# Altium schematic sheet Airbrake Motor Controller.SchDoc
size E
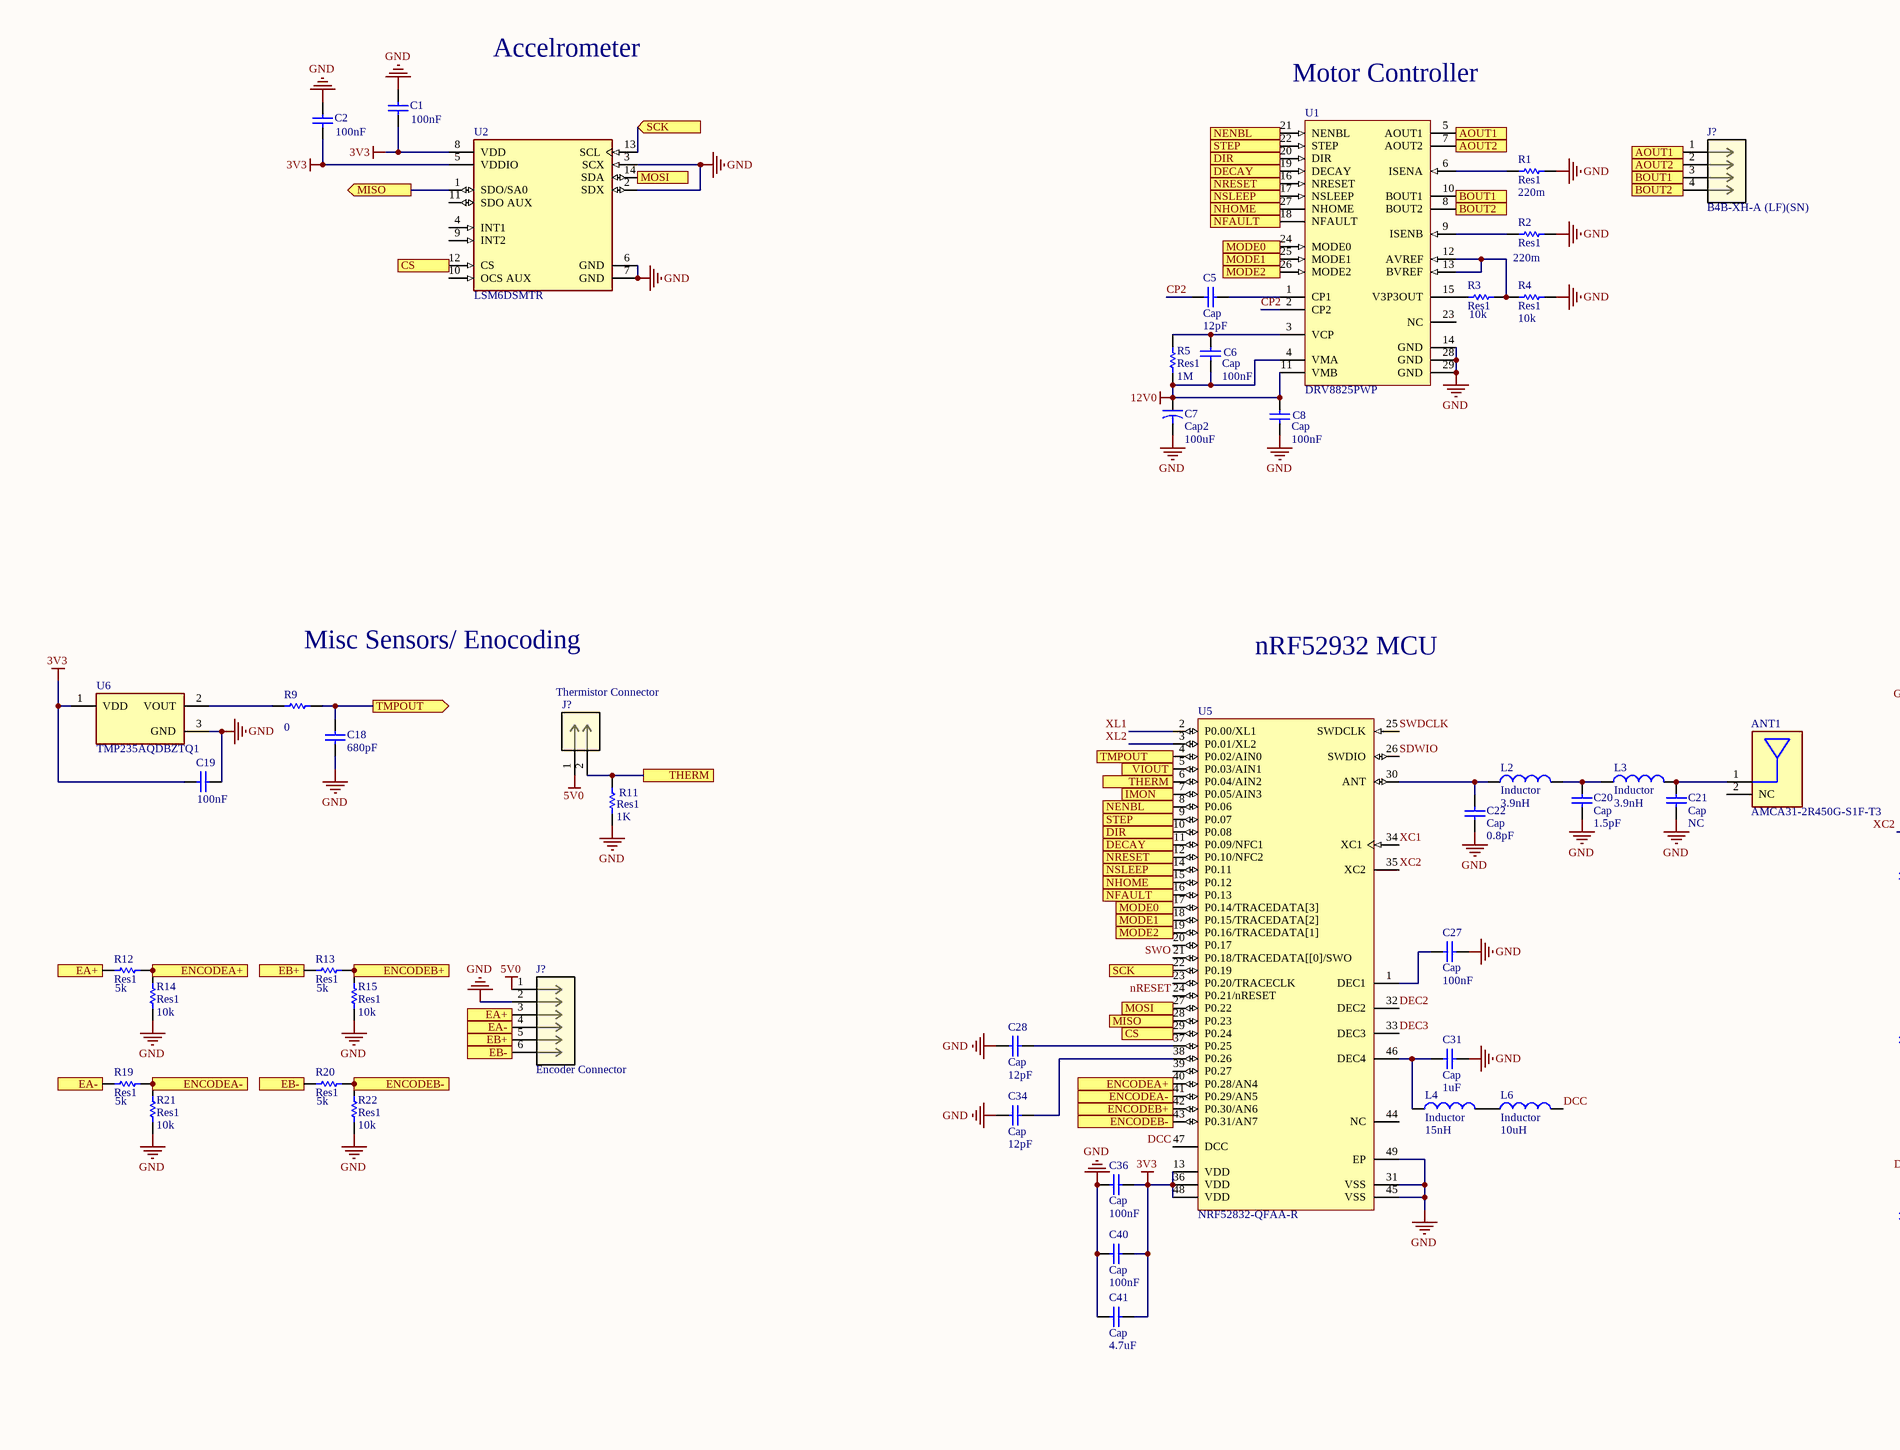
[diagram p0: Airbrake Motor Controller.SchDoc, left]
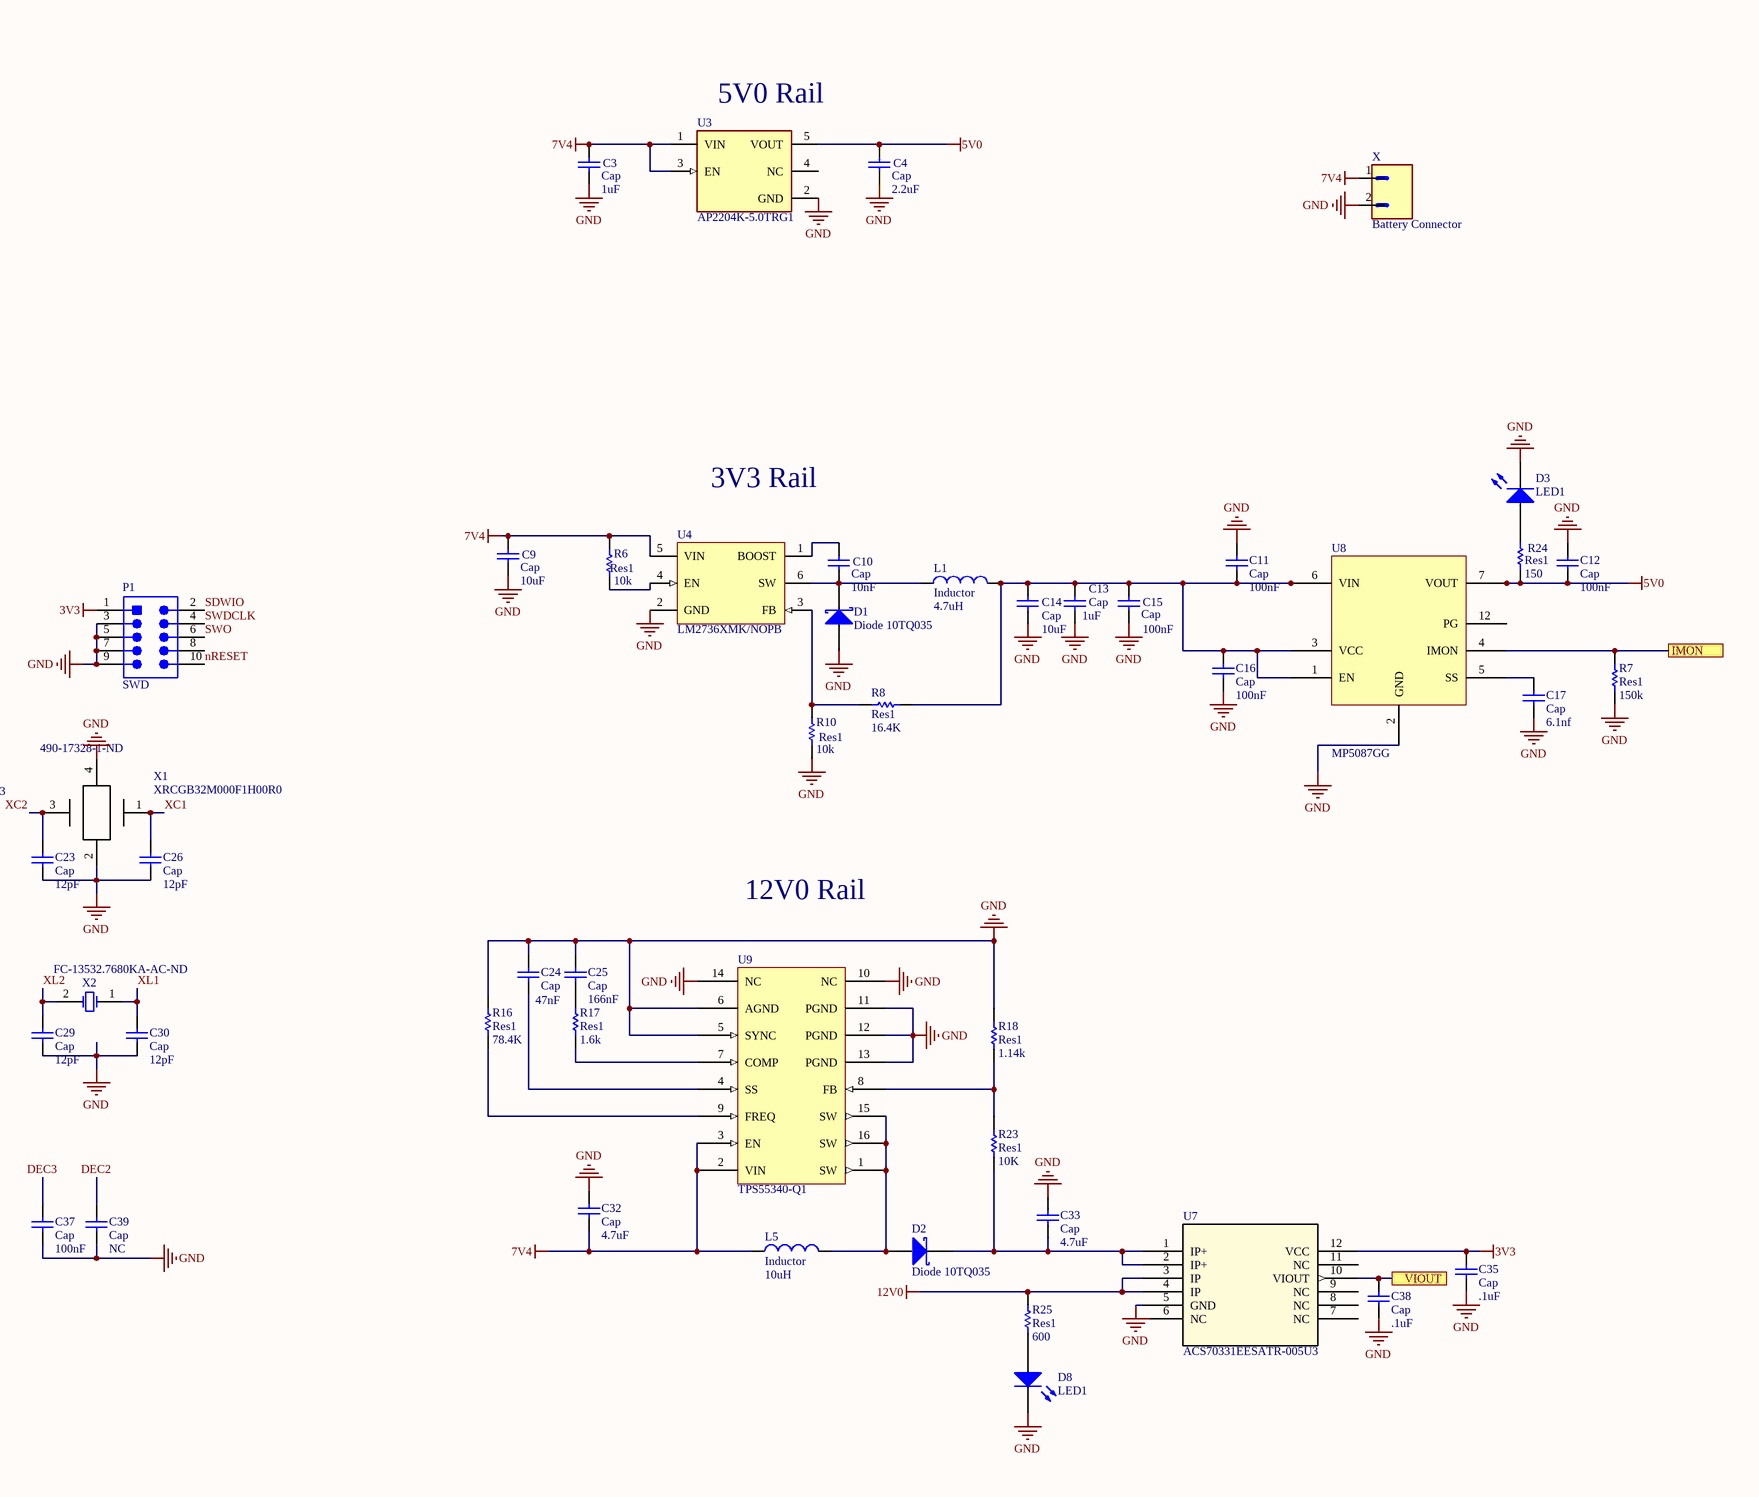
[diagram p1: Airbrake Motor Controller.SchDoc, right]

## Parts
(Parts that share a designator on the sheet are numbered #1, #2 ... from top to bottom, then left to right.)
ANT1  AMCA31-2R450G-S1F-T3  [FP-AMCA31-MFG]
C1  value 100nF  [1608[0603]]  (hidden comment: Cap)
C2  value 100nF  [1608[0603]]  (hidden comment: Cap)
C3  Cap  value 1uF  [1608[0603]]
C4  Cap  value 2.2uF  [1608[0603]]
C5  Cap  value 12pF  [1608[0603]]
C6  Cap  value 100nF  [1608[0603]]
C7  Cap2  value 100uF  [PCAP_8x10-ELECT_NCA]
C8  Cap  value 100nF  [1608[0603]]
C9  Cap  value 10uF  [1608[0603]]
C10  Cap  value 10nF  [1608[0603]]
C11  Cap  value 100nF  [1608[0603]]
C12  Cap  value 100nF  [1608[0603]]
C13  Cap  value 1uF  [1608[0603]]
C14  Cap  value 10uF  [1608[0603]]
C15  Cap  value 100nF  [1608[0603]]
C16  Cap  value 100nF  [1608[0603]]
C17  Cap  value 6.1nf  [1608[0603]]
C18  value 680pF  [1608[0603]]  (hidden comment: Cap)
C19  value 100nF  [1608[0603]]  (hidden comment: Cap)
C20  Cap  value 1.5pF  [0402-A]
C21  Cap  value NC  [0402-A]
C22  Cap  value 0.8pF  [0402-A]
C23  Cap  value 12pF  [RAD-0.3]
C24  Cap  value 47nF  [1608[0603]]
C25  Cap  value 166nF  [1608[0603]]
C26  Cap  value 12pF  [RAD-0.3]
C27  Cap  value 100nF  [RAD-0.3]
C28  Cap  value 12pF  [RAD-0.3]
C29  Cap  value 12pF  [RAD-0.3]
C30  Cap  value 12pF  [RAD-0.3]
C31  Cap  value 1uF  [RAD-0.3]
C32  Cap  value 4.7uF  [1608[0603]]
C33  Cap  value 4.7uF  [1608[0603]]
C34  Cap  value 12pF  [RAD-0.3]
C35  Cap  value .1uF  [1608[0603]]
C36  Cap  value 100nF  [RAD-0.3]
C37  Cap  value 100nF  [RAD-0.3]
C38  Cap  value .1uF  [1608[0603]]
C39  Cap  value NC  [RAD-0.3]
C40  Cap  value 100nF  [RAD-0.3]
C41  Cap  value 4.7uF  [RAD-0.3]
D1  Diode 10TQ035  [TO-220AC]
D2  Diode 10TQ035  [CFP5_SOD128_NEX]
D3  LED1  [LED-1]
D8  LED1  [LED-1]
J?#1  B4B-XH-A (LF)(SN)  [CONN_B4B-XH-A (LF)(SN)_JST]
J?#2  Thermistor Connector  [CONN_B2B-EH-A (LF)(SN)_JST]
J?#3  Encoder Connector  [CONN_B6B-XH-A(LF)(SN)_JST]
L1  Inductor  value 4.7uH  [0402-A]
L2  Inductor  value 3.9nH  [0402-A]
L3  Inductor  value 3.9nH  [0402-A]
L4  Inductor  value 15nH  [0402-A]
L5  Inductor  value 10uH  [IND_IHLP_2525_CZ_VIS]
L6  Inductor  value 10uH  [0402-A]
P1  SWD  [SMTC-FTSH-105-01-L-DV-K_V]
R1  Res1  value 220m  [1608[0603]]
R2  Res1  value 220m  [1608[0603]]
R3  Res1  value 10k  [1608[0603]]
R4  Res1  value 10k  [1608[0603]]
R5  Res1  value 1M  [1608[0603]]
R6  Res1  value 10k  [1608[0603]]
R7  Res1  value 150k  [1608[0603]]
R8  Res1  value 16.4K  [1608[0603]]
R9  value 0  [1608[0603]]  (hidden comment: Res1)
R10  Res1  value 10k  [1608[0603]]
R11  Res1  value 1K  [1608[0603]]
R12  Res1  value 5k  [AXIAL-0.3]
R13  Res1  value 5k  [1608[0603]]
R14  Res1  value 10k  [AXIAL-0.3]
R15  Res1  value 10k  [1608[0603]]
R16  Res1  value 78.4K  [1608[0603]]
R17  Res1  value 1.6k  [1608[0603]]
R18  Res1  value 1.14k  [1608[0603]]
R19  Res1  value 5k  [1608[0603]]
R20  Res1  value 5k  [1608[0603]]
R21  Res1  value 10k  [1608[0603]]
R22  Res1  value 10k  [1608[0603]]
R23  Res1  value 10K  [1608[0603]]
R24  Res1  value 150  [1608[0603]]
R25  Res1  value 600  [1608[0603]]
U1  DRV8825PWP  [PWP0028C_L]
U2  LSM6DSMTR  [FP-LGA-14L-DM00249496-MFG]
U3  AP2204K-5.0TRG1  [FP-SOT25-IPC_B]
U4  LM2736XMK/NOPB  [DDC0006A_L]
U5  NRF52832-QFAA-R  [NRSC-QF-48_M]
U6  TMP235AQDBZTQ1  [FP-DBZ0003A-MFG]
U7  ACS70331EESATR-005U3  [QFN-12_ALM]
U8  MP5087GG  [MP5087GG-Z]
U9  TPS55340-Q1  [TPS55340QRTERQ1]
X  Battery Connector  [B2P-VH]
X1  XRCGB32M000F1H00R0  Supplier Part Number 1: 490-17328-1-ND  [XRCGB32M000F1H00R0]
X2  Supplier Part Number 1: FC-13532.7680KA-AC-ND  [R38]  (hidden comment: FC-135 32.7680KA-AC)

## Ports
AOUT1, AOUT2, BOUT1, BOUT2, CS (in), DECAY, DIR, EA+, EA-, EB+, EB-, ENCODEA+, ENCODEA-, ENCODEB+, ENCODEB-, IMON, MISO (out), MODE0, MODE1, MODE2, MOSI (in), NENBL, NFAULT, NHOME, NRESET, NSLEEP, SCK (in), STEP, THERM, TMPOUT (out), VIOUT

## Nets
3V3: C1.2 C2.2 C19.1 C35.1 C36.1 C40.1 C41.1 P1.1 U2.5(VDDIO) U2.8(VDD) U5.13(VDD) U5.36(VDD) U5.48(VDD) U6.1(VDD) U7.12(VCC)
5V0: C4.2 C12.1 J?#2.1 J?#3.1 R24.1 U3.5(VOUT) U8.7(VOUT) U8.8(VOUT) U8.9(VOUT) U8.10(VOUT)
7V4: C3.2 C9.2 C32.1 L5.1 R6.2 U3.1(VIN) U3.3(EN) U4.5(VIN) U9.2(VIN) U9.3(EN) X.1
12V0: C6.1 C7.1 C8.2 R5.1 R25.2 U1.4(VMA) U1.11(VMB) U7.3(IP) U7.4(IP)
GND: C1.1 C2.1 C3.1 C4.1 C7.2 C8.1 C9.1 C11.2 C12.2 C13.1 C14.1 C15.1 C16.1 C17.1 C18.2 C19.2 C20.1 C21.1 C22.1 C23.1 C24.2 C25.2 C26.1 C27.1 C28.2 C29.1 C30.1 C31.1 C32.2 C33.2 C34.2 C35.2 C36.2 C37.2 C38.2 C39.2 C40.2 C41.2 D1.3(A) D3.2(K) D8.2(K) J?#3.2 P1.3 P1.5 P1.7 P1.9 R1.1 R2.1 R4.1 R7.1 R10.1 R11.1 R14.2 R15.2 R16.2 R18.2 R21.2 R22.2 U1.14(GND) U1.28(GND) U1.29(GND) U2.2(SDX) U2.3(SCX) U2.6(GND) U2.7(GND) U3.2(GND) U4.2(GND) U5.31(VSS) U5.45(VSS) U5.49(EP) U6.3(GND) U7.5(GND) U8.2(GND) U9.5(SYNC) U9.6(AGND) U9.10(NC) U9.11(PGND) U9.12(PGND) U9.13(PGND) U9.14(NC) X.2 X1.2 X1.4
AOUT1: J?#1.1 U1.5(AOUT1) ; port AOUT1
AOUT2: J?#1.2 U1.7(AOUT2) ; port AOUT2
BOUT1: J?#1.3 U1.10(BOUT1) ; port BOUT1
BOUT2: J?#1.4 U1.8(BOUT2) ; port BOUT2
CP2: C5.2 U1.2(CP2)
CS: U2.12(CS) U5.29(P0.24) ; port CS
DCC: L6.2 U5.47(DCC)
DEC2: C39.1 U5.32(DEC2)
DEC3: C37.1 U5.33(DEC3)
DECAY: U1.19(DECAY) U5.11(P0.09/NFC1) ; port DECAY
DIR: U1.20(DIR) U5.10(P0.08) ; port DIR
EA+: J?#3.3 R12.2 ; port EA+
EA-: J?#3.4 R19.2 ; port EA-
EB+: J?#3.5 R13.2 ; port EB+
EB-: J?#3.6 R20.2 ; port EB-
ENCODEA+: R12.1 R14.1 U5.40(P0.28/AN4) ; port ENCODEA+
ENCODEA-: R19.1 R21.1 U5.41(P0.29/AN5) ; port ENCODEA-
ENCODEB+: R13.1 R15.1 U5.42(P0.30/AN6) ; port ENCODEB+
ENCODEB-: R20.1 R22.1 U5.43(P0.31/AN7) ; port ENCODEB-
IMON: R7.2 U5.7(P0.05/AIN3) U8.4(IMON) ; port IMON
MISO: U2.1(SDO/SA0) U5.28(P0.23) ; port MISO
MODE0: U1.24(MODE0) U5.17(P0.14/TRACEDATA[3]) ; port MODE0
MODE1: U1.25(MODE1) U5.18(P0.15/TRACEDATA[2]) ; port MODE1
MODE2: U1.26(MODE2) U5.19(P0.16/TRACEDATA[1]) ; port MODE2
MOSI: U2.14(SDA) U5.27(P0.22) ; port MOSI
NENBL: U1.21(NENBL) U5.8(P0.06) ; port NENBL
NFAULT: U1.18(NFAULT) U5.16(P0.13) ; port NFAULT
NHOME: U1.27(NHOME) U5.15(P0.12) ; port NHOME
NRESET: U1.16(NRESET) U5.12(P0.10/NFC2) ; port NRESET
nRESET: P1.10 U5.24(P0.21/nRESET)  [a separate net that carries the same name]
NSLEEP: U1.17(NSLEEP) U5.14(P0.11) ; port NSLEEP
SCK: U2.13(SCL) U5.22(P0.19) ; port SCK
SDWIO: P1.2 U5.26(SWDIO)
STEP: U1.22(STEP) U5.9(P0.07) ; port STEP
SWDCLK: P1.4 U5.25(SWDCLK)
SWO: P1.6 U5.21(P0.18/TRACEDATA[[0]/SWO)
THERM: J?#2.2 R11.2 U5.6(P0.04/AIN2) ; port THERM
TMPOUT: C18.1 R9.2 U5.4(P0.02/AIN0) ; port TMPOUT
VIOUT: C38.1 U5.5(P0.03/AIN1) U7.10(VIOUT) ; port VIOUT
XC1: C26.2 U5.34(XC1) X1.1
XC2: C23.2 U5.35(XC2) X1.3
XL1: C30.2 U5.2(P0.00/XL1) X2.1(OSC1)
XL2: C29.2 U5.3(P0.01/XL2) X2.2(OSC2)
NetANT1_1: ANT1.1(Feed_Point) C21.2 L3.2
NetC5_1: C5.1 U1.1(CP1)
NetC6_2: C6.2 R5.2 U1.3(VCP)
NetC10_1: C10.1 D1.1(K) L1.1 U4.6(SW)
NetC10_2: C10.2 U4.1(BOOST)
NetC11_1: C11.1 C13.2 C14.2 C15.2 C16.2 L1.2 R8.1 U8.1(EN) U8.3(VCC) U8.6(VIN) U8.11(VOUT)
NetC17_2: C17.2 U8.5(SS)
NetC20_2: C20.2 L2.2 L3.1
NetC22_2: C22.2 L2.1 U5.30(ANT)
NetC24_1: C24.1 U9.4(SS)
NetC25_1: C25.1 R17.2
NetC27_2: C27.2 U5.1(DEC1)
NetC28_1: C28.1 U5.37(P0.25)
NetC31_2: C31.2 L4.1 U5.46(DEC4)
NetC33_1: C33.1 D2.1(K) R23.1 U7.1(IP+) U7.2(IP+)
NetC34_1: C34.1 U5.38(P0.26)
NetD2_3: D2.3(A) L5.2 U9.1(SW) U9.15(SW) U9.16(SW)
NetD3_1: D3.1(A) R24.2
NetD8_1: D8.1(A) R25.1
NetL4_2: L4.2 L6.1
NetR1_2: R1.2 U1.6(ISENA)
NetR2_2: R2.2 U1.9(ISENB)
NetR3_1: R3.1 R4.2 U1.12(AVREF) U1.13(BVREF)
NetR3_2: R3.2 U1.15(V3P3OUT)
NetR6_1: R6.1 U4.4(EN)
NetR8_2: R8.2 R10.2 U4.3(FB)
NetR9_1: R9.1 U6.2(VOUT)
NetR16_1: R16.1 U9.9(FREQ)
NetR17_1: R17.1 U9.7(COMP)
NetR18_1: R18.1 R23.2 U9.8(FB)

Not connected (* = marked no-connect by the designer): ANT1 2(NC); P1 8; U1 23(NC); U2 4(INT1) 9(INT2) 10(OCS_AUX) 11(SDO_AUX); U3 4(NC); U5 20(P0.17) 23(P0.20/TRACECLK) 39(P0.27) 44(NC); U7 6(NC) 7(NC) 8(NC) 9(NC) 11(NC); U8 12(PG)

## Notes on the sheet
- Accelrometer
- (near U1) Motor Controller
- (near U3) 5V0 Rail
- 3V3 Rail
- Misc Sensors/ Enocoding
- nRF52932 MCU
- 12V0 Rail

## Library data of the parts
ANT1 = CMP-27836-000002-1: RF ANT 2.4GHZ CHIP SOLDER SMD; Manufacturer: Abracon; Power Rating: 3W; Max Frequency: 2450MHz; Impedance: 50Ω; Number Of Bands: 1; Bandwidth: 100MHz; RoHS: TRUE; ComponentLink2Description: Datasheet; Category: Ant; Temperature: -40°C to +85°C; Device Class L3: RF Antennas; Octopart: https://octopart.com/amca31-2r450g-s1f-t3-abracon-31435383; Manufacturer Part Number: AMCA31-2R450G-S1F-T3; Digikey Description: RF ANT 2.4GHZ CHIP SOLDER SMD; Package: AMCA31; Temperature Range High: +85°C; Automotive: No; Device Class L2: RF Semiconductors and Devices; ComponentLink2URL: https://abracon.com/chip-antenna/AMCA31-2R450G-S1F-T3.pdf; Temperature Range Low: -40°C; Device Class L1: Integrated Circuits (ICs); Lead Free: Yes; Height: 1.4mm; Mouser Description: Antennas 2.45GHz BW 90dB + Gain -1 dBi avg.
C1-C6 C8-C41 = Cap: Capacitor; Published: 8-Jun-2000; LatestRevisionDate: 17-Jul-2002; LatestRevisionNote: Re-released for DXP Platform.; PackageReference: RAD-0.3; Publisher: Altium Limited; PackageDescription: Radial Cap, Thru-Hole; 2 Leads; 0.3 in Pin Spacing
C7 = Cap2: Capacitor; Published: 23-Sep-2002; PackageReference: CAPR5-4X5; Publisher: Altium Limited; PackageDescription: Capacitor; 2 Leads
D1 D2 = Diode 10TQ035: Schottky Rectifier; Note: Terminal 2 is the TAB and is electrically connected to the cathode; Published: 8-Jun-2000; LatestRevisionDate: 17-Jul-2002; LatestRevisionNote: Re-released for DXP Platform.; DatasheetVersion: PD-2.057B; PackageVersion: Feb-1998; PackageReference: TO-220AC; Publisher: Altium Limited; PackageDescription: TO, Thru-Hole, Vertical, Heatsink Mounted; 3 In-Line Leads (1 Absent); Pitch 2.54 mm; ComponentLink1Description: Manufacturer Link; ComponentLink1URL: http://www.irf.com/; ComponentLink2Description: Datasheet; ComponentLink2URL: http://www.irf.com/product-info/datasheets/data/10tq.pdf
D3 D8 = LED1: Typical RED GaAs LED; Published: 8-Jun-2000; LatestRevisionDate: 08-Jul-2005; LatestRevisionNote: Mech Layer 1 removed.; PackageReference: LED-1; Publisher: Altium Limited; PackageDescription: LED; 2 Leads
J?#1 = B4B-XH-A (LF)(SN): No Description Available; Vendor: JST; Built_By: EMA_Cory; SourceLibrary: JST_2020-02-03; Datasheet: http://www.jst-mfg.com/product/pdf/eng/eXH.pdf; Manufacturer_Part_Number: B4B-XH-A (LF)(SN); Copyright: Copyright (C) 2018 Accelerated Designs. All rights reserved; RefDes: RefDes; Type: DEV
J?#2 = B2B-EH-A (LF)(SN): No Description Available; Vendor: JST; Built_By: EMA_TJ; SourceLibrary: JST_2019-01-31; Copyright: Copyright (C) 2018 Accelerated Designs. All rights reserved; Manufacturer_Part_Number: B2B-EH-A (LF)(SN); RefDes: RefDes; Type: DEV
J?#3 = B6B-XH-A(LF)(SN): No Description Available; Vendor: JST; Built_By: EMA_Cory; SourceLibrary: JST_2019-12-02; Manufacturer_Part_Number: B6B-XH-A(LF)(SN); Copyright: Copyright (C) 2018 Accelerated Designs. All rights reserved; RefDes: RefDes; Type: DEV
L1-L6 = Inductor: Code_IEC: 1005; Published: 8-Jun-2000; LatestRevisionDate: 29-May-2009; LatestRevisionNote: IPC-7351 Footprint Added.; PackageReference: 0402-A; Publisher: Altium Limited; PackageDescription: Chip Inductor; Code_JEITA: 0402
P1 = CMP-2000-05353-1: Male Header, Pitch 1.27 mm, 2 x 5 Position, Height 6.25 mm; Manufacturer: Samtec; Pitch: 0.050"(1.27mm); Other Names: Q3937619; Number of Positions: 10; Mating Products: SFMC-105-L2-S-D-TR-ND / -CONN.05"SURFACE10POSSMT / FLE-105-01-G-DV-TR-ND / -CONNSKT1.27MM10POSDUALSMD / FLE-105-01-G-DV-A-P-ND / -CONNSKT1.27MM10POSDUALSMD / FLE-105-01-G-DV-A-ND / -CONNSKT1.27MM10POSDUALSMD / CLP-105-02-G-D-P-TR-ND / -CONNRCPT10POSDUAL.05"SMD / SAM1155-05-ND / -CONNRCPT10POSDUAL.05"SMD / SAM1154-05-ND / -CONNRCPT10POSDUAL.05"SMD / SAM1153-05-ND / -CONNRCPT10POSDUAL.05"SMD / SAM1226-05-ND / -CONNRCPT.05"10POSDUALSMD; Number of Positions Loaded: All; Connector Type: Header,Unshrouded; Product Training Modules: Board-to-BoardConnectors; Datasheet Version: Rev. ET, 10/1995; Number of Rows: 2; Standard Package: 1; Package Description: Male Header, Pitch 1.27 mm, 2 x 5 Position, Height 5.97 mm, Tail Length 4.32 mm; Contact Finish Thickness: 10µin(0.25µm); Series: FTSH; Termination: Solder; Contact Type: MalePin; Color: Black; Package Reference: FTSH-105-01-L-DV-K; Family: RectangularConnectors-Headers,MalePins; Package URL: http://suddendocs.samtec.com/prints/ftsh-1xx-xx-xxx-dv-xxx-footprint.pdf; Packaging: Tube; Mounting Type: SurfaceMount; Category: Connectors,Interconnects; Datasheet URL: http://suddendocs.samtec.com/prints/ftsh-1xx-xx-xxx-dv-xxx-mkt.pdf; Row Spacing: 0.050"(1.27mm); Manufacturer URL: http://www.samtec.com/; Contact Mating Length: 0.120"(3.05mm); Contact Finish: Gold
R1-R25 = Res1: Resistor; Published: 8-Jun-2000; LatestRevisionDate: 17-Jul-2002; LatestRevisionNote: Re-released for DXP Platform.; PackageReference: AXIAL-0.3; Publisher: Altium Limited; PackageDescription: Axial Device, Thru-Hole; 2 Leads; 0.3 in Pin Spacing
U1 = CMP-1685-00019-1: Stepper Motor Controller IC, 8.2 to 45 V, -40 to 85 degC, 28-Pin HTSSOP (PWP), Green (RoHS & no Sb/Br), Tube; Voltage Rating: 100 V; Tolerance: 20%; Capacitance: 47 uF; Case\Package: Radial; ComponentLink2URL: http://www.ti.com/general/docs/lit/getliterature.tsp?genericPartNumber=DRV8825&fileType=pdf; Voltage Rating (DC): 100 V; Lead Pitch: 3.5 mm; Diameter: 8 mm; DatasheetVersion: SLVSA73F, 07/2014; ComponentLink2Description: Datasheet; Package Quantity: 200; PackageDescription: 28-Pin Small Outline Package Integrated Circuit, Body 9.7 x 4.4 mm, Pitch 0.65 mm; Packaging: Bulk; Pins: 2; Min Operating Temperature: -40 degC; Width: 8 mm; ComponentLink1Description: Manufacturer URL; Length: 11.5 mm; Max Operating Temperature: 85 degC; Height: 11.5 mm; REACH SVHC: No SVHC; Mount: Through Hole; PackageReference: PWP0028C; RoHSCompliant: true; Radiation Hardening: No; ComponentLink1URL: http://www.ti.com/
U2 = CMP-12177-000008-1: IMU ACCEL/GYRO I2C/SPI 14LGA; Manufacturer: STMicroelectronics; Operating Supply Current: 0.29-0.65mA; Gyro Range: 125/250/500/1000/2000°/s; Sensor Output: I2C,SPI; Accel Range: 2/4/8/16g; Min Supply Voltage: 1.62V; Resolution: 16bits; Sensor Type: Temperature,Accelerometer,Gyroscope; Max Supply Voltage: 3.6V; Manufacturer Part Number: LSM6DSMTR; Octopart: https://octopart.com/lsm6dsmtr-stmicroelectronics-66358194; Height: 0.86mm; Category: IC; Lead Free: Yes; Temperature: -40°C to +85°C; Temperature Range Low: -40°C; ComponentLink2Description: Datasheet; ComponentLink2URL: https://www.st.com/resource/en/datasheet/lsm6dsm.pdf; Digikey Description: IMU ACCEL/GYRO I2C/SPI 14LGA; Footprint Url: https://www.st.com/content/ccc/resource/technical/document/technical_note/73/17/9c/16/dd/96/4a/01/CD00134799.pdf/files/CD00134799.pdf/jcr:content/translations/en.CD00134799.pdf; Device Class L1: Sensors; Device Class L2: Motion Sensors; Temperature Range High: +85°C; Mouser Description: LSM6DSM Series 3.6 V I2C/SPI 3D Accelerometer and 3D Gyroscope - LGA-14; Device Class L3: Inertial Measurement Units (IMUs); Automotive: No; Package: LGA-14L-DM00249496; RoHS: TRUE
U3 = CMP-12756-000033-1: IC REG LINEAR 5V 150MA SOT23-5; Operating Supply Current: 50uA; Number of Outputs: 1; Output Type: Fixed; Power Supply Rejection Ratio (PSRR): 60dB; Max Output Current: 250mA; Dropout Voltage: 360mV; Reference Voltage: 1.265V; Polarity: Positive; Max Input Voltage: 24V; Min Input Voltage: 2.3V; Min Operating Temperature: -40°C; Max Operating Temperature: 85°C; Case/Package: SOT-23-5; Quiescent Current: 50uA; Width: 1.7mm; Number of Regulators: 1; Package Quantity: 3000; Length: 3.02mm; Lead Free: Lead Free; Number of Pins: 5; Weight: 0.001058oz; Packaging: Tape and Reel; Mount: Surface Mount; Output Voltage: 5V; Output Current: 150mA; Height: 1.3mm
U4 = CMP-0069-01211-3: 750mA Load Step-Down DC-DC Regulator, 6-pin Tiny SOT23, Pb-Free; Manufacturer: Texas Instruments; PowerWise: N; CompType: Switcher; PackageTopMarking: SHAB*XTT; Code_IPC: SOT26A-6; PackageDescription: Molded TSOT, 2.97 x 1.65 x 0.87mm Body, 6 Lead, 0.95mm Pitch; ComponentLink1Description: Datasheet URL; RoHS: Y; ComponentLink1URL: http://www.ti.com/general/docs/lit/getliterature.tsp?genericPartNumber=LM2736&fileType=pdf; PinCount: 6; PackageReference: DDC0006A; Code_JEDEC: MO-193-AA
U5 = CMP-2100-03661-1: Multiprotocol Bluetooth Smart, ANT/ANT+ and Proprietary System-on-Chip, 2.4 GHz, 256 KB FLASH, 1.7 to 3.6 V, -40 to 85 degC, 48-Pin QFN, RoHS, Tape and Reel; Manufacturer: Nordic Semiconductor; Frequency: 2.4GHz; Datasheet Version: Rev. 1.0, 02/2016; Datasheet URL: http://infocenter.nordicsemi.com/pdf/nRF52832_PS_v1.0.pdf; Mount: SurfaceMount; Max Operating Temperature: 85degC; Manufacturer URL: http://www.nordicsemi.com/eng/Products/; Lead Free: LeadFree; Min Operating Temperature: -40degC; RoHSCompliant: true; Package Reference: QF-48; Package Description: 48-Pin Quad Flat No-lead Package, Body 6 x 6 mm, Pitch 0.4 mm, Thermal Pad 4.6 x 4.6 mm; Max Frequency: 2.4GHz; Packaging: TapeandReel
U6 = CMP-04948-000003-1: LOW-POWER HIGH-ACCURACY ANALOG O; Manufacturer: Texas Instruments; Manufacturer Part Number: TMP235A2DBZR; Output Current: 500uA; Operating Supply Current: 9uA; Max Supply Voltage: 5.5V; Max Junction Temp: +150°C; Accuracy: 0.5%; Min Supply Voltage: 2.3V; Standoff Height: 0.01mm; Sensor Output: Analog Voltage; Ambient Temperature Range Low: -40°C; Device Class L2: Temperature and Humidity Sensors; Digikey Description: LOW-POWER HIGH-ACCURACY ANALOG O; Lead Free: Yes; Category: IC; Device Class L3: unset; Temperature Range Low: -40°C; ComponentLink2Description: Datasheet; Package: DBZ0003A; Octopart: https://octopart.com/tmp235a2dbzr-texas+instruments-94966376; Device Class L1: Sensors; Temperature Range High: +150°C; Height: 1.12mm; Temperature: -40°C to +150°C; RoHS: TRUE; Ambient Temperature Range High: +150°C; Automotive: No; ComponentLink2URL: http://www.ti.com/lit/ds/symlink/tmp235.pdf; Mouser Description: ±2°C Analog output temperature sensor, with 10mV /°C gain 3-SOT-23 -40 to 150
U7 = ACS70331EESATR-005U3: No Description Available; Vendor: Allegro Microsystems Inc.; Built_By: EMA_Molly; SourceLibrary: Allegro_2019-12-17; Manufacturer_Part_Number: ACS70331EESATR-005U3; Copyright: Copyright (C) 2018 Accelerated Designs. All rights reserved; RefDes: RefDes; Type: DEV
U8 U9 = Component_1
X = B2P-VH(LF)(SN): Connector Header Through Hole 2 position 0.156 _3.96mm_; MP: B2P-VH_LF__SN_; MF: JST Sales; Value: *; Package: None; Price: None; Availability: Unavailable; SnapEDA_Link: https://www.snapeda.com/parts/B2P-VH%28LF%29%28SN%29/JST%20Sales%20America%20Inc./view-part/104373/?ref=snap
X1 = XRCGB32M000F1H00R0: 32MHz Crystal Oscillator; Supplier 1: Digi-Key
X2 = XTAL: 32.768kHz Crystal Oscillator; Published: 8-Jun-2000; LatestRevisionDate: 17-Jul-2002; LatestRevisionNote: Re-released for DXP Platform.; PackageReference: R38; Publisher: Altium Limited; PackageDescription: Crystal, Thru-Hole; 2 Leads; Body 3.1 x 8.2 mm (Dia.xH); Supplier 1: Digi-Key